# EAGLE design PwrSplit (EAGLE 8.5.0)
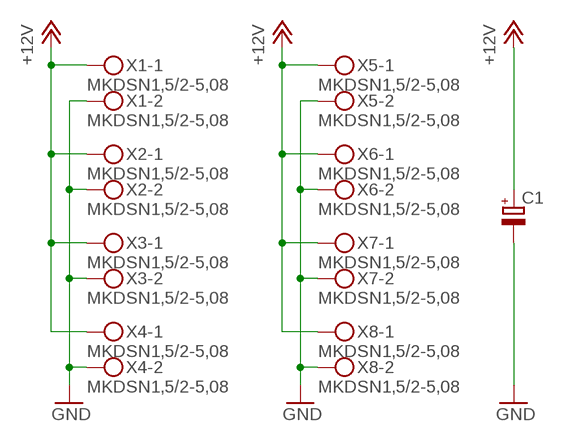
[diagram p0: schematic, sheet 1]

## Parts
C1  ECAP  [E5-13]
X1  MKDSN1,5/2-5,08  [MKDSN1,5/2-5,08]
X2  MKDSN1,5/2-5,08  [MKDSN1,5/2-5,08]
X3  MKDSN1,5/2-5,08  [MKDSN1,5/2-5,08]
X4  MKDSN1,5/2-5,08  [MKDSN1,5/2-5,08]
X5  MKDSN1,5/2-5,08  [MKDSN1,5/2-5,08]
X6  MKDSN1,5/2-5,08  [MKDSN1,5/2-5,08]
X7  MKDSN1,5/2-5,08  [MKDSN1,5/2-5,08]
X8  MKDSN1,5/2-5,08  [MKDSN1,5/2-5,08]

## Nets
+12V: C1.+ X1.1 X2.1 X3.1 X4.1 X5.1 X6.1 X7.1 X8.1
GND: C1.- X1.2 X2.2 X3.2 X4.2 X5.2 X6.2 X7.2 X8.2

## Library data of the parts
C1 = newlib:ECAP
X1-X8 = con-phoenix-508:MKDSN1,5/2-5,08: MKDSN 1,5/ 2-5,08 Printklemme Nennstrom: 13,5 A Nennspannung: 250 V Rastermaß: 5,08 mm Polzahl: 2 Anschlussart: Schraubanschluss Montage: Löten Anschlussrichtung Leiter/Platine: 0 ° Artikelnummer: 1729128 Source: http://eshop.phoenixcontact.com .. 1729128.pdf

## Board
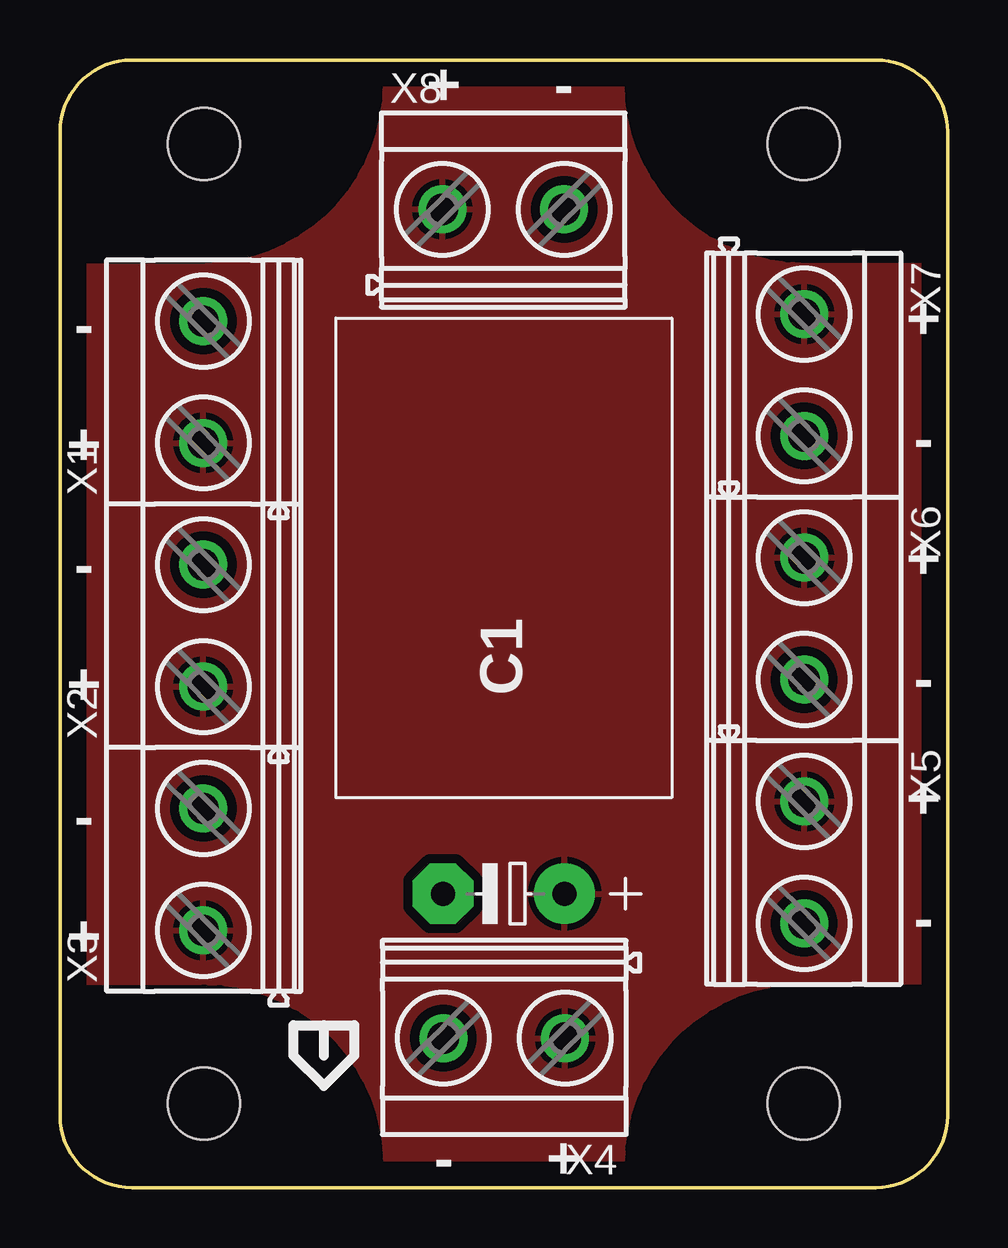
[diagram p1: board, top side]
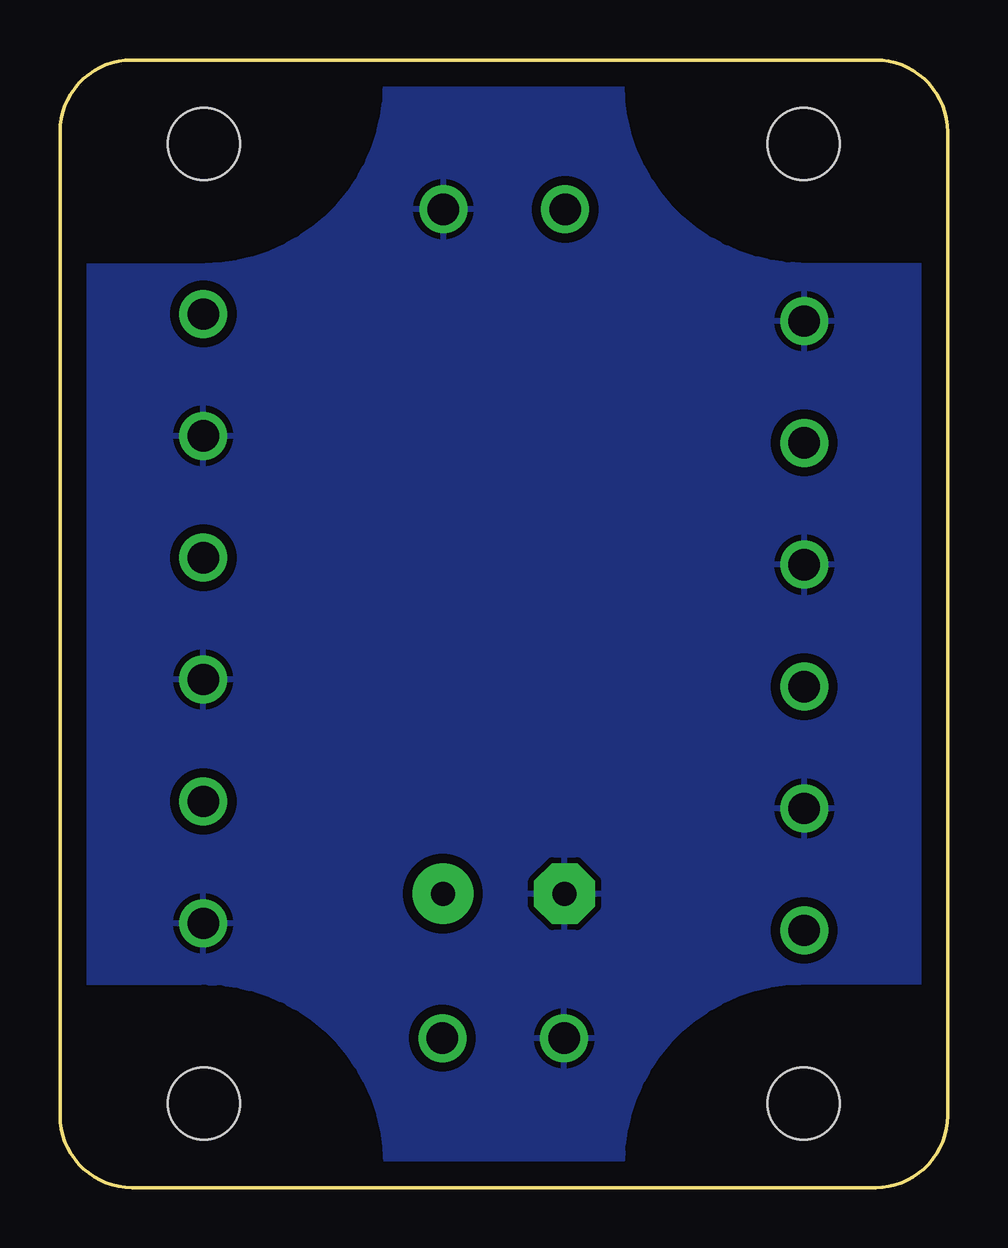
[diagram p2: board, bottom side, seen from below]

Size 37 x 47 mm. Coordinates in mm from the lower left corner, seen from the top.
Outline: 34,47 3,47 arc90 0,44 0,3 arc90 3,0 34,0 arc90 37,3 37,44 arc90 34,47
Copper layers (1*16): Top 0.035mm / dielectric 1.5mm / Bottom 0.035mm
Design rules "default": minimum track width 6mil, minimum drill 0.35mm, track to track 6mil, track to pad 6mil, pad to pad 6mil, via to via 6mil, smd to smd 6mil, copper to edge 40mil, drill to drill 6mil, minimum pad ring 10mil, minimum via ring 8mil, stop-mask expansion 4mil, vias tented up to drill 0mil, thermal gap 10mil
Holes 3 mm at 6,3.5 31,3.5 31,43.5 6,43.5
tRestrict: area 0,39 to 13,46; area 24,39 to 37,46; area 0,1 to 13,8; area 24,1 to 37,8
bRestrict: area 0,39 to 13,46; area 24,39 to 37,46; area 0,1 to 13,8; area 24,1 to 37,8

### Footprints (pad centres in the part's own frame; a part is rotated, then mirrored left to right if it is on the bottom)
E5-13 = drill 1 pad 2.54: + 2.54,0 | drill 1 pad 2.54 octagon: - -2.54,0
MKDSN1,5/2-5,08 = drill 1.3 pad 2: 1 -2.561,0.025; 2 2.519,0.025

### Placement (x,y rotation side)
C1  18.5,12.25 0 top
U$1  [MASKLABEL]  11,5.5 0 top
X1  6,33.6 90 top
X2  6,23.44 90 top
X3  6,13.28 90 top
X4  18.5,6.25 180 top
X5  31,13.53 270 top
X6  31,23.69 270 top
X7  31,33.85 270 top
X8  18.5,40.75 0 top

### Tracks (layer width: path | path; a pad name or v marks a point on that pad's centre or on a via)
+12V
  pour Top (isolate 0.381): 0,47 37,47 37,0 0,0
GND
  pour Bottom (isolate 0.381): 0,47 37,47 37,0 0,0

### Text on the board
tPlace: + | - | - | + | + | - | - | + | + | - | - | + | - | + | - | +